# EAGLE design arduino_328p (EAGLE 9.6.2)
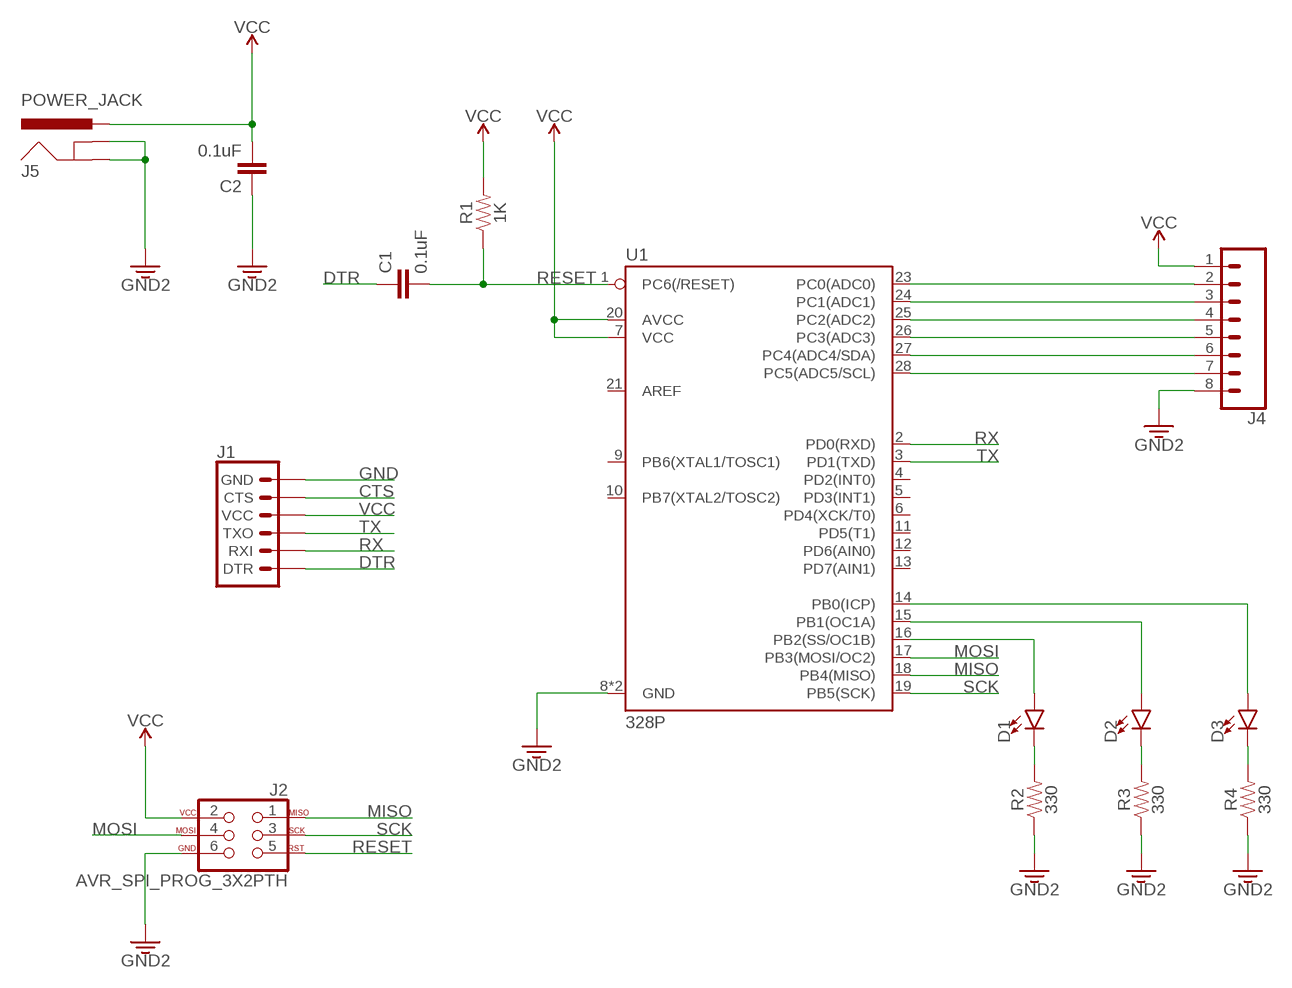
[diagram p0: schematic, sheet 1]

## Parts
C1  0.1uF  0.1UF-0402-6.3V-10%-X7R  [0402]
C2  0.1uF  0.1UF-0402-6.3V-10%-X7R  [0402]
D1  LED1206  [LED-1206]
D2  LED1206  [LED-1206]
D3  LED1206  [LED-1206]
J1  6_PIN_SERIAL_TARGETPTH-KIT  [1X06-KIT]
J2  AVR_SPI_PROG_3X2PTH  [2X3]
J4  CONN_08"  [1X08]
J5  POWER_JACK  [POWER_JACK_PTH]
R1  1K  0.22OHM-0805-1/4W-1%  [0805]
R2  330  0.22OHM-0805-1/4W-1%  [0805]
R3  330  0.22OHM-0805-1/4W-1%  [0805]
R4  330  0.22OHM-0805-1/4W-1%  [0805]
U1  328P  ATMEGA328P_PDIP  [DIP28]

## Nets
CTS: J1.5(CTS)
DTR: C1.1 J1.1(DTR)
GND: C2.1 J1.6(GND) J2.6 J4.8 J5.GND J5.GNDBREAK R2.1 R3.1 R4.1 U1.8(GND) U1.22(GND) ; supply symbol labelled GND2
MISO: J2.1 U1.18(PB4(MISO))
MOSI: J2.4 U1.17(PB3(MOSI/OC2))
N$2: J4.2 U1.23(PC0(ADC0))
N$3: J4.3 U1.24(PC1(ADC1))
N$4: J4.4 U1.25(PC2(ADC2))
N$5: J4.5 U1.26(PC3(ADC3))
N$6: J4.6 U1.27(PC4(ADC4/SDA))
N$7: J4.7 U1.28(PC5(ADC5/SCL))
N$8: D1.C R2.2
N$9: D2.C R3.2
N$10: D1.A U1.16(PB2(SS/OC1B))
N$11: D2.A U1.15(PB1(OC1A))
N$12: D3.A U1.14(PB0(ICP))
N$13: D3.C R4.2
RESET: C1.2 J2.5 R1.1 U1.1(PC6(/RESET))
RX: J1.2(RXI) U1.2(PD0(RXD))
SCK: J2.3 U1.19(PB5(SCK))
TX: J1.3(TXO) U1.3(PD1(TXD))
VCC: C2.2 J1.4(VCC) J2.2 J4.1 J5.PWR R1.2 U1.7(VCC) U1.20(AVCC)
Unconnected: U1.4(PD2(INT0)) U1.5(PD3(INT1)) U1.6(PD4(XCK/T0)) U1.9(PB6(XTAL1/TOSC1)) U1.10(PB7(XTAL2/TOSC2)) U1.11(PD5(T1)) U1.12(PD6(AIN0)) U1.13(PD7(AIN1)) U1.21(AREF)

## Library data of the parts
C1 C2 = SparkFun-Capacitors:0.1UF: 0.1µF ceramic capacitors A capacitor is a passive two-terminal electrical component used to store electrical energy temporarily in an electric field.; PROD_ID: CAP-14993
D1-D3 = SparkFun-LED:LED: LED (Generic) Standard schematic elements and footprints for 5mm, 3mm, 1206, and 0603 sized LEDs. Generic LEDs with no color specified.
J1 = SparkFun-Connectors:6_PIN_SERIAL_TARGET: 6-pin header connection for use with the "FTDI BASIC" pinout - TARGET SIDE. Also known as "Arduino Serial Program Header". It is used to mate with our FTDI Basic serial programmers using the Arduino IDE. Note, this device has "TARGET" in the name. It is intended to be used on a design that contains a target micro-controller that you wish to program. The "sister" device, named "CABLE" is inteneded to be used on a design that usually lives on the end of your USB cable and prvides the converter chip (FTDI232 or FTDI231x) to commnicate serial RX/TX. You can populate with some of these: Break Away Headers - Straight <https://www.sparkfun.com/products/116> (PRT-00116) For reference (or to suit your programming needs) check out these designs: SparkFun FTDI Basic Breakout - 5V <https://www.sparkfun.com/products/9716> (DEV-09716) SparkFun FTDI Basic Breakout - 3.3V <https://www.sparkfun.com/products/9873> (DEV-09873) SparkFun FTDI SmartBasic <https://www.sparkfun.com/products/12935> (DEV-12935) SparkFun Beefy 3 - FTDI Basic Breakout <https://www.sparkfun.com/products/13746> (DEV-13746)
J2 = SparkFun-Connectors:AVR_SPI_PROG_3X2: AVR ISP 6 Pin This is the reduced ISP connector for AVR programming. Common on Arduino. This footprint will take up less PCB space and can be used with a 10-pin to 6-pin adapter such as SKU: BOB-08508 **Special note about "TEST_POINT" package. The stop mask is on the top side, so if you want your programming test points to be on the bottom of your board, make sure to place this package on the bottom side of the board. This also ensure that the orientation to program from the bottom side will be correct. SparkFun Products: SparkFun ISP Pogo Adapter <https://www.sparkfun.com/products/11591> - NS Tiny AVR Programmer <https://www.sparkfun.com/products/11801> -PTH
J4 = SparkFun-Connectors:CONN_08: Multi connection point. Often used as Generic Header-pin footprint for 0.1 inch spaced/style header connections On any of the 0.1 inch spaced packages, you can populate with these: Break Away Headers - Straight <https://www.sparkfun.com/products/116> (PRT-00116) Break Away Male Headers - Right Angle <https://www.sparkfun.com/products/553> (PRT-00553) Female Headers <https://www.sparkfun.com/products/115> (PRT-00115) Break Away Headers - Machine Pin <https://www.sparkfun.com/products/117> (PRT-00117) Break Away Female Headers - Swiss Machine Pin <https://www.sparkfun.com/products/743> (PRT-00743) Arduino Stackable Header - 8 Pin <https://www.sparkfun.com/products/9279> (PRT-09279) For SCREWTERMINALS and SPRING TERMINALS visit here: Screw Terimnals on SparkFun.com <https://www.sparkfun.com/search/results?term=Screw+Terminals> (5mm/3.5mm/2.54mm spacing) This device is also useful as a general connection point to wire up your design to another part of your project. Our various solder wires solder well into these plated through hole pads. Hook-Up Wire - Assortment (Stranded, 22 AWG) <https://www.sparkfun.com/products/11375> (PRT-11375) Hook-Up Wire - Assortment (Solid Core, 22 AWG) <https://www.sparkfun.com/products/11367> (PRT-11367) View the entire wire category on our website here <https://www.sparkfun.com/categories/141> Special notes: Molex polarized connector foot print use with SKU : PRT-08231 with associated crimp pins and housings. 1MM SMD Version SKU: PRT-10208 NOTES ON THE VARIANTS LOCK and LOCK_LONGPADS... This footprint was designed to help hold the alignment of a through-hole component (i.e. 6-pin header) while soldering it into place. You may notice that each hole has been shifted either up or down by 0.005 of an inch from it's more standard position (which is a perfectly straight line). This slight alteration caused the pins (the squares in the middle) to touch the edges of the holes. Because they are alternating, it causes a "brace" to hold the component in place. 0.005 has proven to be the perfect amount of "off-center" position when using our standard breakaway headers. Although looks a little odd when you look at the bare footprint, once you have a header in there, the alteration is very hard to notice. Also,if you push a header all the way into place, it is covered up entirely on the bottom side.; PROD_ID: CONN-08438
J5 = SparkFun-Connectors:POWER_JACK: Power Jack Connector This is the standard 5.5mm barrel jack for power. The PTH is the most common, proven, reliable, footprint. The Slot footprint only works if the mill layer is transmitted to the PCB fab house so be warned. Here are the connectors we sell at SparkFun: DC Barrel Power Jack/Connector <https://www.sparkfun.com/products/119> (PRT-00119) DC Barrel Power Jack/Connector (SMD) <https://www.sparkfun.com/products/12748> (PRT-12748) DC Barrel Jack Adapter - Breadboard Compatible <https://www.sparkfun.com/products/10811> (PRT-10811) It is used on this SparkFun product (and many, many others): SparkFun RedBoard - Programmed with Arduino <https://www.sparkfun.com/products/12757> (DEV-12757) Also, if you need a mating power supply or connector, please check these out: Wall Adapter Power Supply - 9VDC 650mA <https://www.sparkfun.com/products/298> (TOL-00298) DC Barrel Jack Adapter - Male <https://www.sparkfun.com/products/10287> (PRT-10287); PROD_ID: CONN-08197
R1-R4 = SparkFun-Resistors:0.22OHM: 0.22Ω resistor A resistor is a passive two-terminal electrical component that implements electrical resistance as a circuit element. Resistors act to reduce current flow, and, at the same time, act to lower voltage levels within circuits. - Wikipedia; PROD_ID: RES-09883; VALUE: 0.22
U1 = SparkFun-IC-Microcontroller:ATMEGA328P_PDIP: Atmel 328P Through hole ATMEGA328P uC used in the Arduino 32kb flash, 1k EEPROM, 2k SRAM Datasheet <http://www.sparkfun.com/datasheets/Components/SMD/ATMega328.pdf> SparkFun Products Storefront component: AVR 28 Pin 20MHz 32K 6A/D - ATMega328P <https://www.sparkfun.com/products/9061> (COM-09061) SparkFun Simon Says - Through-Hole Soldering Kit <https://www.sparkfun.com/products/10547> (KIT-10547) SparkFun Learn to Solder - Simon Says <https://www.sparkfun.com/products/13708> (KIT-13708) SparkFun BigTime Watch Kit <https://www.sparkfun.com/products/11734> (KIT-11734) SparkFun ClockIt <https://www.sparkfun.com/products/10930> (KIT-10930) SparkFun Serial Enabled LCD Kit <https://www.sparkfun.com/products/10097> (LCD-10097) SparkFun Simon Tilts - Through Hole Soldering Kit <https://www.sparkfun.com/products/12634> (KIT-12634) SparkFun Frequency Counter Kit <https://www.sparkfun.com/products/10140> (KIT-10140) FabFM Radio Kit <https://www.sparkfun.com/products/11043> (KIT-11043) SparkFun Binary Blaster Kit <https://www.sparkfun.com/products/12037> (KIT-12037) SparkFun Metro-Gnome <https://www.sparkfun.com/products/9236> (KIT-09236) ATmega328 with Arduino Optiboot (Uno) <https://www.sparkfun.com/products/10524> (DEV-10524); PROD_ID: IC-09136

## Board
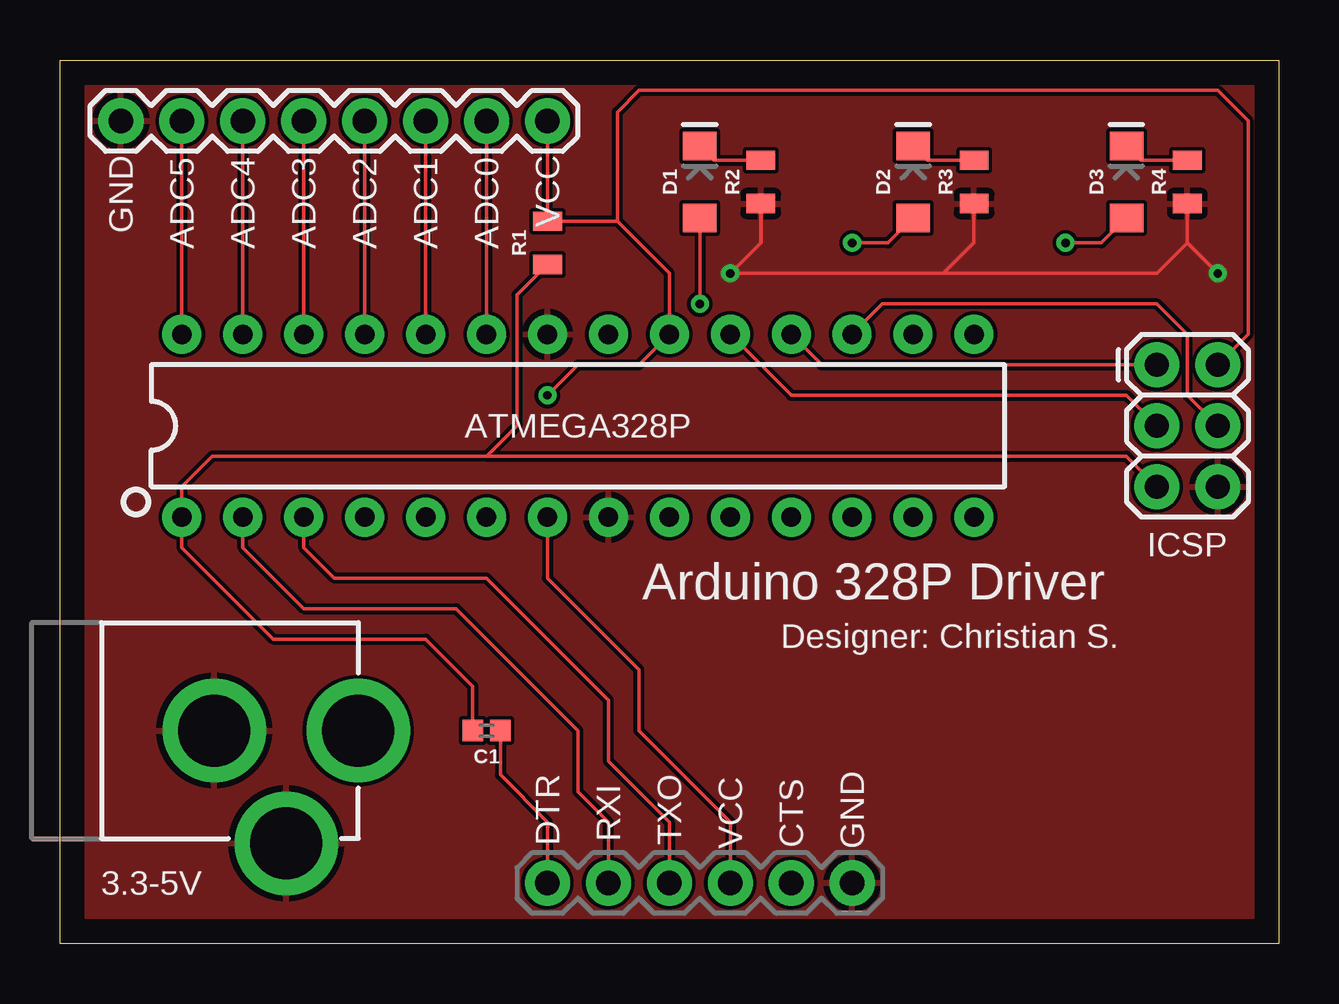
[diagram p1: board, top side]
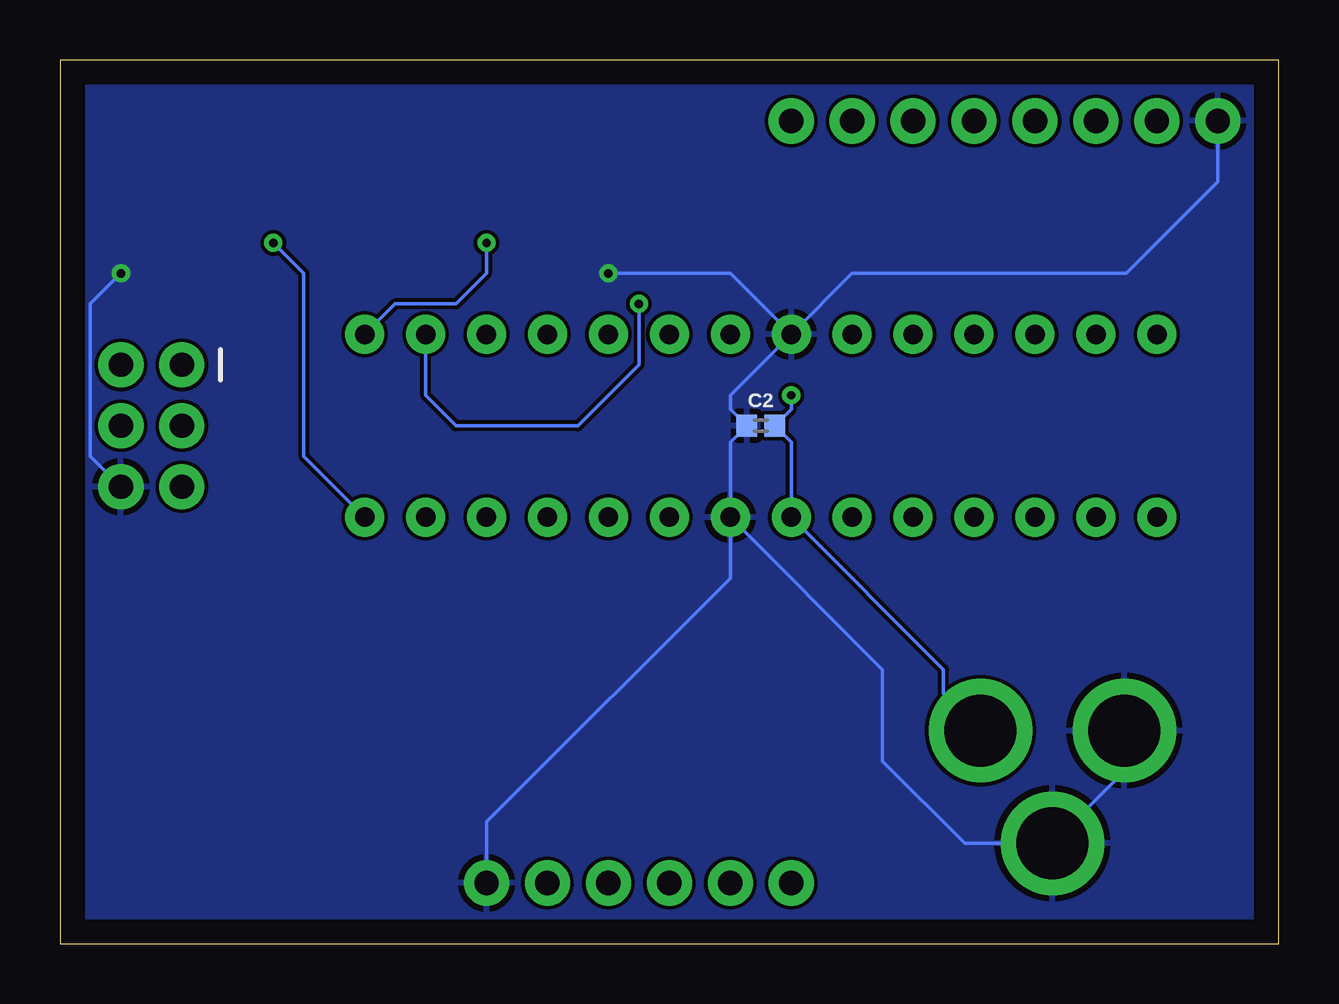
[diagram p2: board, bottom side, seen from below]

Size 50.8 x 36.83 mm. Coordinates in mm from the lower left corner, seen from the top.
Outline: 0,0 0,36.83 50.8,36.83 50.8,0 0,0
Copper layers (1*16): Top 0.035mm / dielectric 1.5mm / Bottom 0.035mm
Design rules "default": minimum track width 6mil, minimum drill 0.35mm, track to track 6mil, track to pad 6mil, pad to pad 6mil, via to via 6mil, smd to smd 6mil, copper to edge 40mil, drill to drill 6mil, minimum pad ring 10mil, minimum via ring 8mil, stop-mask expansion 4mil, vias tented up to drill 0mil, thermal gap 10mil

### Footprints (pad centres in the part's own frame; a part is rotated, then mirrored left to right if it is on the bottom)
0402 = smd 0.85 x 0.9: 1 -0.58,0; 2 0.58,0
LED-1206 = smd 1.2 x 1.4: A -1.5,0; C 1.5,0
1X06-KIT = drill 1.016 pad 1.88: 1 0,0; 2 2.54,0; 3 5.08,0; 4 7.62,0; 5 10.16,0; 6 12.7,0
2X3 = drill 1.016 pad 1.88: 1 0,0; 2 0,2.54; 3 2.54,0; 4 2.54,2.54; 5 5.08,0; 6 5.08,2.54
1X08 = drill 1.016 pad 1.88: 1 0,0; 2 2.54,0; 3 5.08,0; 4 7.62,0; 5 10.16,0; 6 12.7,0; 7 15.24,0; 8 17.78,0
POWER_JACK_PTH = drill 2.997 pad 4.318: GND 0,7.7; GNDBREAK 4.7,10.7; PWR 0,13.7
0805 = smd 0.8 x 1.2: 1 -0.9,0; 2 0.9,0
DIP28 = drill 0.813 pad 1.626: 1 -16.51,-3.81; 2 -13.97,-3.81; 3 -11.43,-3.81; 4 -8.89,-3.81; 5 -6.35,-3.81; 6 -3.81,-3.81; 7 -1.27,-3.81; 8 1.27,-3.81; 9 3.81,-3.81; 10 6.35,-3.81; 11 8.89,-3.81; 12 11.43,-3.81; 13 13.97,-3.81; 14 16.51,-3.81; 15 16.51,3.81; 16 13.97,3.81; 17 11.43,3.81; 18 8.89,3.81; 19 6.35,3.81; 20 3.81,3.81; 21 1.27,3.81; 22 -1.27,3.81; 23 -3.81,3.81; 24 -6.35,3.81; 25 -8.89,3.81; 26 -11.43,3.81; 27 -13.97,3.81; 28 -16.51,3.81

### Placement (x,y rotation side)
C1  17.78,8.89 180 top
C2  21.59,21.59 0 bottom
D1  26.67,31.75 90 top
D2  35.56,31.75 90 top
D3  44.45,31.75 90 top
J1  20.32,2.54 0 top
J2  45.72,24.13 270 top
J4  20.32,34.29 180 top
J5  -1.27,8.89 270 top
R1  20.32,29.21 90 top
R2  29.21,31.75 90 top
R3  38.1,31.75 90 top
R4  46.99,31.75 90 top
U1  21.59,21.59 0 top

### Tracks (layer width: path | path; a pad name or v marks a point on that pad's centre or on a via)
DTR
  Top 0.152: C1.1 18.36,7.04 20.32,5.08 J1.1 | J1.1
GND  (via drill 0.35)
  Top 0.152: 29.21,30.48 R2.1 29.21,29.21 v27.94,27.94 36.83,27.94 | 36.83,27.94 45.72,27.94 46.99,29.21 | R3.1 38.1,29.21 36.83,27.94 | R4.1 46.99,29.21 | 46.99,29.21 v48.26,27.94
  Bottom 0.152: J5.GND 6.43,7.19 J5.GNDBREAK 13.08,4.19 16.51,7.62 16.51,11.43 U1.8 | J4.8 2.54,31.75 6.35,27.94 17.78,27.94 U1.22 | v27.94,27.94 22.86,27.94 U1.22 | v48.26,27.94 49.53,26.67 49.53,20.32 J2.6 | U1.22 22.86,22.86 22.86,22.28 C2.1 22.86,20.9 U1.8 | U1.8 22.86,15.24 32.75,5.35 33.02,5.08 | 33.02,5.08 | 33.02,5.08 J1.6
  pour Bottom: 0,0 0,36.83 50.8,36.83 50.8,0
  pour Top: 0,0 0,36.83 50.8,36.83 50.8,0
MISO
  Top 0.152: U1.18 31.75,24.13 J2.1
MOSI
  Top 0.152: J2.4 46.99,22.86 46.99,25.4 45.72,26.67 34.29,26.67 U1.17
N$2
  Top 0.152: J4.2 U1.23
N$3
  Top 0.152: J4.3 U1.24
N$4
  Top 0.152: J4.4 U1.25
N$5
  Top 0.152: J4.5 U1.26
N$6
  Top 0.152: J4.6 U1.27
N$7
  Top 0.152: J4.7 U1.28
N$8
  Top 0.152: D1.C 27.27,32.65 R2.2
N$9
  Top 0.152: D2.C 36.16,32.65 R3.2
N$10  (via drill 0.35)
  Top 0.152: D1.A v26.67,26.67
  Bottom 0.152: v26.67,26.67 26.67,24.13 29.21,21.59 34.29,21.59 35.56,22.86 U1.16
N$11  (via drill 0.35)
  Top 0.152: D2.A 34.52,29.21 v33.02,29.21
  Bottom 0.152: v33.02,29.21 33.02,27.94 34.29,26.67 36.83,26.67 U1.15
N$12  (via drill 0.35)
  Top 0.152: D3.A 43.41,29.21 v41.91,29.21
  Bottom 0.152: v41.91,29.21 40.64,27.94 40.64,20.32 U1.14
N$13
  Top 0.152: D3.C 45.05,32.65 R4.2
RESET
  Top 0.152: R1.1 19.05,27.04 19.05,21.59 17.78,20.32 | 17.78,20.32 6.35,20.32 5.08,19.05 U1.1 5.08,16.51 8.89,12.7 15.24,12.7 17.2,10.74 C1.2 | 17.78,20.32 44.45,20.32 J2.5
RX
  Top 0.152: U1.2 7.62,16.51 10.16,13.97 16.51,13.97 21.59,8.89 21.59,6.35 22.86,5.08 | J1.2 22.86,5.08 | 22.86,5.08
SCK
  Top 0.152: U1.19 30.48,22.86 44.45,22.86 J2.3
TX
  Top 0.152: U1.3 10.16,16.51 11.43,15.24 17.78,15.24 22.86,10.16 22.86,7.62 25.4,5.08 J1.3 | J1.3
VCC  (via drill 0.35)
  Top 0.152: J4.1 R1.2 23.23,30.11 | 23.23,30.11 25.4,27.94 U1.20 24.13,24.13 21.59,24.13 v20.32,22.86 | U1.7 20.32,15.24 24.13,11.43 24.13,8.89 27.94,5.08 J1.4 | 23.23,30.11 23.23,34.66 24.13,35.56 48.26,35.56 49.53,34.29 49.53,25.4 J2.2 | J1.4
  Bottom 0.152: v20.32,22.86 20.32,22.28 C2.2 20.32,20.9 U1.7 13.97,11.43 13.97,10.43 J5.PWR

### Text on the board
tPlace: GND | ADC5 | ADC4 | ADC3 | ADC2 | ADC1 | ADC0 | VCC | ATMEGA328P | ICSP | Arduino 328P Driver | Designer: Christian S. | DTR | TXO | GND | RXI | VCC | CTS | 3.3-5V | /home/christian/Documents/open-herb/media/icon-transparent.bmp | /home/christian/Documents/open-herb/media/icon-transparent.bmp | /home/christian/Documents/open-herb/media/icon-transparent.bmp